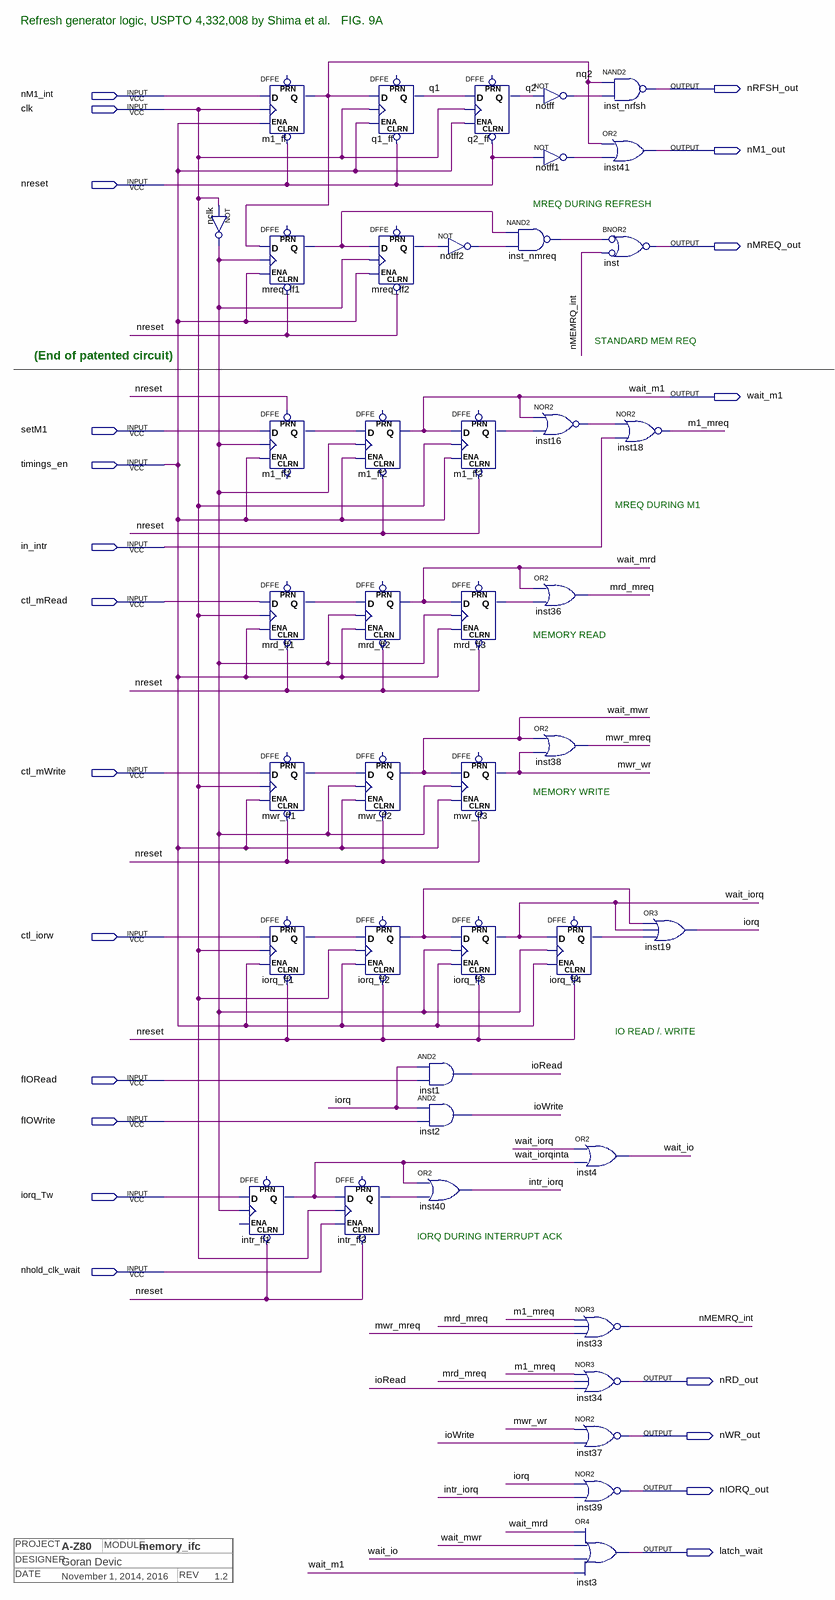
[diagram p0: schematic sheet]
// Quartus schematic memory_ifc.bdf as structural Verilog: 42 symbols, 21 pins
// Title block: PROJECT: A-Z80; MODULE: memory_ifc; DESIGNER: Goran Devic; DATE: November 1, 2014, 2016; REV: 1.2
module memory_ifc (
  input  nM1_int,
  input  clk,
  input  nreset,
  input  setM1,
  input  timings_en,
  input  in_intr,
  input  ctl_mRead,
  input  ctl_mWrite,
  input  ctl_iorw,
  input  fIORead,
  input  fIOWrite,
  input  iorq_Tw,
  input  nhold_clk_wait,
  output nRFSH_out,
  output nM1_out,
  output nMREQ_out,
  output wait_m1,
  output nRD_out,
  output nWR_out,
  output nIORQ_out,
  output latch_wait
);

  wire inst16_out, inst_nmreq_out, intr_ff3_q, intr_iorq, ioRead, iorq, iorq_ff1_q, iorq_ff2_q, iorq_ff4_q,
       ioWrite, m1_ff1_q, m1_ff3_q, m1_ff_q, m1_mreq, mrd_ff1_q, mrd_ff3_q, mrd_mreq, mreq_ff1_q, mreq_ff2_q,
       mwr_ff1_q, mwr_mreq, mwr_wr, nclk_out, nMEMRQ_int, notff1_out, notff2_out, nq2, q1, q2, wait_io,
       wait_iorq, wait_iorqinta, wait_mrd, wait_mwr;

  not nclk (nclk_out, clk);
  DFFE intr_ff1 (.CLRN(nreset), .D(iorq_Tw), .CLK(nclk_out), .Q(wait_iorqinta));  // open: PRN, ENA
  DFFE m1_ff (.CLRN(nreset), .D(nM1_int), .CLK(clk), .ENA(timings_en), .Q(m1_ff_q));  // open: PRN
  DFFE mreq_ff1 (.CLRN(nreset), .D(m1_ff_q), .CLK(nclk_out), .ENA(timings_en), .Q(mreq_ff1_q));  // open: PRN
  DFFE m1_ff1 (.PRN(nreset), .D(setM1), .CLK(nclk_out), .ENA(timings_en), .Q(m1_ff1_q));  // open: CLRN
  DFFE mrd_ff1 (.CLRN(nreset), .D(ctl_mRead), .CLK(clk), .ENA(timings_en), .Q(mrd_ff1_q));  // open: PRN
  DFFE mwr_ff1 (.CLRN(nreset), .D(ctl_mWrite), .CLK(clk), .ENA(timings_en), .Q(mwr_ff1_q));  // open: PRN
  DFFE iorq_ff1 (.CLRN(nreset), .D(ctl_iorw), .CLK(clk), .ENA(timings_en), .Q(iorq_ff1_q));  // open: PRN
  DFFE m1_ff2 (.CLRN(nreset), .D(m1_ff1_q), .CLK(nclk_out), .ENA(timings_en), .Q(wait_m1));  // open: PRN
  DFFE mrd_ff2 (.CLRN(nreset), .D(mrd_ff1_q), .CLK(nclk_out), .ENA(timings_en), .Q(wait_mrd));  // open: PRN
  DFFE mwr_ff2 (.CLRN(nreset), .D(mwr_ff1_q), .CLK(nclk_out), .ENA(timings_en), .Q(wait_mwr));  // open: PRN
  DFFE iorq_ff2 (.CLRN(nreset), .D(iorq_ff1_q), .CLK(clk), .ENA(timings_en), .Q(iorq_ff2_q));  // open: PRN
  DFFE intr_ff3 (.CLRN(nreset), .D(wait_iorqinta), .CLK(clk), .ENA(nhold_clk_wait), .Q(intr_ff3_q));  // open: PRN
  DFFE q1_ff (.CLRN(nreset), .D(m1_ff_q), .CLK(clk), .ENA(timings_en), .Q(q1));  // open: PRN
  DFFE mreq_ff2 (.CLRN(nreset), .D(mreq_ff1_q), .CLK(nclk_out), .ENA(timings_en), .Q(mreq_ff2_q));  // open: PRN
  and inst1 (ioRead, iorq, fIORead);
  and inst2 (ioWrite, iorq, fIOWrite);
  or inst40 (intr_iorq, wait_iorqinta, intr_ff3_q);
  DFFE q2_ff (.CLRN(nreset), .D(q1), .CLK(clk), .ENA(timings_en), .Q(q2));  // open: PRN
  not notff2 (notff2_out, mreq_ff2_q);
  DFFE m1_ff3 (.CLRN(nreset), .D(wait_m1), .CLK(clk), .ENA(timings_en), .Q(m1_ff3_q));  // open: PRN
  DFFE mrd_ff3 (.CLRN(nreset), .D(wait_mrd), .CLK(nclk_out), .ENA(timings_en), .Q(mrd_ff3_q));  // open: PRN
  DFFE mwr_ff3 (.CLRN(nreset), .D(wait_mwr), .CLK(nclk_out), .ENA(timings_en), .Q(mwr_wr));  // open: PRN
  DFFE iorq_ff3 (.CLRN(nreset), .D(iorq_ff2_q), .CLK(nclk_out), .ENA(timings_en), .Q(wait_iorq));  // open: PRN
  nand inst_nmreq (inst_nmreq_out, mreq_ff1_q, notff2_out);
  not notff (nq2, q2);
  not notff1 (notff1_out, nreset);
  nor inst16 (inst16_out, wait_m1, m1_ff3_q);
  or inst36 (mrd_mreq, wait_mrd, mrd_ff3_q);
  or inst38 (mwr_mreq, wait_mwr, mwr_wr);
  DFFE iorq_ff4 (.CLRN(nreset), .D(wait_iorq), .CLK(nclk_out), .ENA(timings_en), .Q(iorq_ff4_q));  // open: PRN
  or inst4 (wait_io, wait_iorq, wait_iorqinta);
  nor inst33 (nMEMRQ_int, m1_mreq, mrd_mreq, mwr_mreq);
  nor inst34 (nRD_out, m1_mreq, mrd_mreq, ioRead);
  nor inst37 (nWR_out, mwr_wr, ioWrite);
  nor inst39 (nIORQ_out, iorq, intr_iorq);
  or inst3 (latch_wait, wait_mrd, wait_mwr, wait_io, wait_m1);
  nand inst_nrfsh (nRFSH_out, m1_ff_q, nq2);
  or inst41 (nM1_out, m1_ff_q, notff1_out);
  nor inst (nMREQ_out, ~inst_nmreq_out, ~nMEMRQ_int);  // BNOR2
  nor inst18 (m1_mreq, inst16_out, in_intr);
  or inst19 (iorq, iorq_ff2_q, wait_iorq, iorq_ff4_q);

  // Notes on the sheet:
  //   Refresh generator logic, USPTO 4,332,008 by Shima et al.   FIG. 9A
  //   MREQ DURING REFRESH
  //   STANDARD MEM REQ
  //   (End of patented circuit)
  //   MREQ DURING M1
  //   MEMORY READ
  //   MEMORY WRITE
  //   IO READ /. WRITE
  //   IORQ DURING INTERRUPT ACK
endmodule
